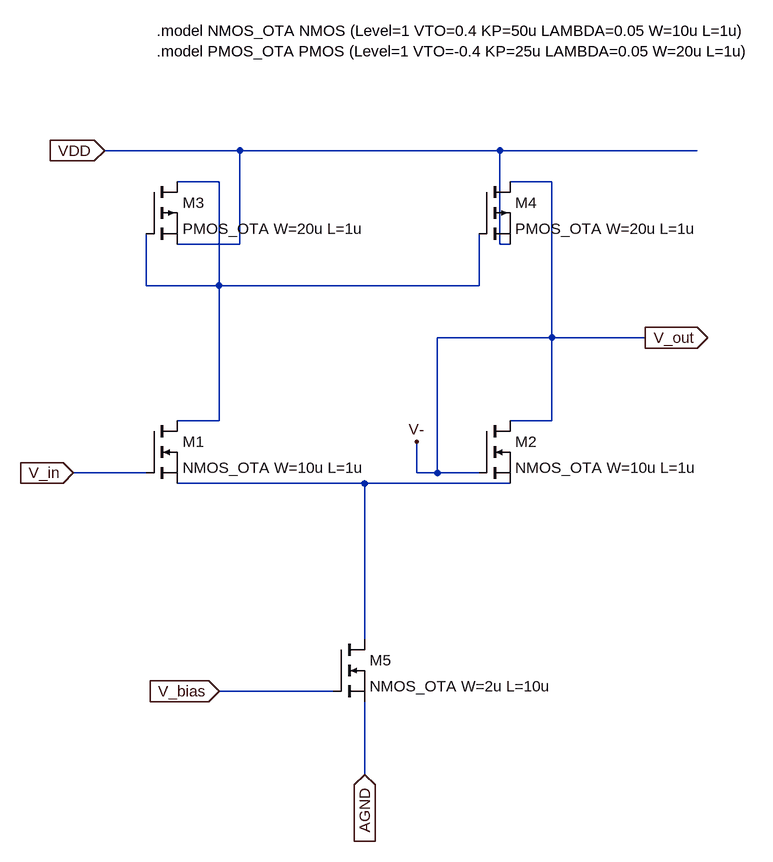
[diagram p0: schematic ota_buffer.asc]
ota_buffer.asc, the LTspice schematic file:
Version 4.1
SHEET 1 1004 736
WIRE 160 -352 -48 -352
WIRE 560 -352 160 -352
WIRE 864 -352 560 -352
WIRE 128 -304 64 -304
WIRE 640 -304 576 -304
WIRE 160 -208 160 -352
WIRE 160 -208 64 -208
WIRE 560 -208 560 -352
WIRE 576 -208 560 -208
WIRE 16 -144 16 -224
WIRE 128 -144 128 -304
WIRE 128 -144 16 -144
WIRE 528 -144 528 -224
WIRE 528 -144 128 -144
WIRE 640 -64 640 -304
WIRE 640 -64 464 -64
WIRE 784 -64 640 -64
WIRE 128 64 128 -144
WIRE 128 64 64 64
WIRE 640 64 640 -64
WIRE 640 64 576 64
WIRE 16 144 -96 144
WIRE 432 144 432 96
WIRE 464 144 464 -64
WIRE 464 144 432 144
WIRE 528 144 464 144
WIRE 352 160 64 160
WIRE 576 160 352 160
WIRE 352 400 352 160
WIRE 304 480 128 480
WIRE 352 608 352 496
FLAG -48 -352 VDD
IOPIN -48 -352 In
FLAG 352 608 AGND
IOPIN 352 608 In
FLAG -96 144 V_in
IOPIN -96 144 In
FLAG 432 96 V-
FLAG 784 -64 V_out
IOPIN 784 -64 Out
FLAG 128 480 V_bias
IOPIN 128 480 In
SYMBOL nmos 16 64 R0
SYMATTR InstName M1
SYMATTR Value NMOS_OTA W=10u L=1u
SYMBOL nmos 528 64 R0
SYMATTR InstName M2
SYMATTR Value NMOS_OTA W=10u L=1u
SYMBOL pmos 16 -304 R0
SYMATTR InstName M3
SYMATTR Value PMOS_OTA W=20u L=1u
SYMBOL pmos 528 -304 R0
SYMATTR InstName M4
SYMATTR Value PMOS_OTA W=20u L=1u
SYMBOL nmos 304 400 R0
SYMATTR InstName M5
SYMATTR Value NMOS_OTA W=2u L=10u
TEXT 32 -536 Left 2 !.model NMOS_OTA NMOS (Level=1 VTO=0.4 KP=50u LAMBDA=0.05 W=10u L=1u)\n.model PMOS_OTA PMOS (Level=1 VTO=-0.4 KP=25u LAMBDA=0.05 W=20u L=1u)

The netlist it stands for:
* ota_buffer.asc
M1 N001 V_in N002 N002 NMOS_OTA W=10u L=1u
M2 V_out V_out N002 N002 NMOS_OTA W=10u L=1u
M3 N001 N001 VDD VDD PMOS_OTA W=20u L=1u
M4 V_out N001 VDD VDD PMOS_OTA W=20u L=1u
M5 N002 V_bias AGND AGND NMOS_OTA W=2u L=10u
.model NMOS NMOS
.model PMOS PMOS
.lib standard.mos
.model NMOS_OTA NMOS (Level=1 VTO=0.4 KP=50u LAMBDA=0.05 W=10u L=1u)
.model PMOS_OTA PMOS (Level=1 VTO=-0.4 KP=25u LAMBDA=0.05 W=20u L=1u)
.backanno
.end